# Altium project IMU V1.PrjPcb (part 1 of 2)
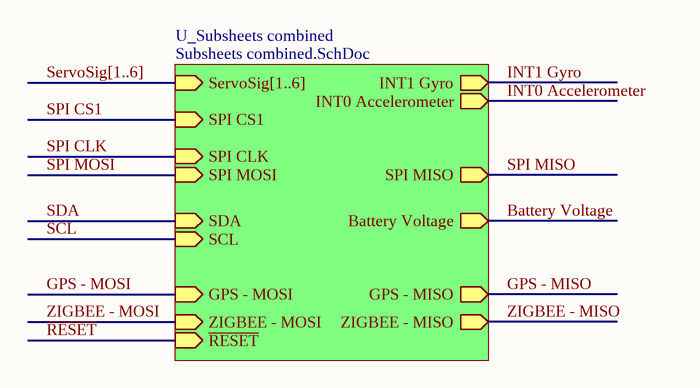
[diagram p0: main.SchDoc]
16 sheets, 83 parts. Net scope: hierarchical (ports join the sheet entries above them; power ports are global).
Board files: IMU V1.PcbDoc, Frame.PcbDoc, IMU V2.PcbDoc
Sheets:
  main.SchDoc
    U_Subsheets combined = Subsheets combined.SchDoc
      U_Accelerometer 3-AXIS - BMA180 = Accelerometer 3-AXIS - BMA180.SchDoc
      U_GYRO 3-AXIS - ITG-3200 = GYRO 3-AXIS - ITG-3200.SchDoc
      U_Pressure sensor - SCP1000-D01 = Pressure sensor - SCP1000-D01.SchDoc
      U_Temperature sensor - TC1046VNBTR = Temperature sensor - TC1046VNBTR.SchDoc
      PSU 5v1A = SMPS 1000mA - LM22672.SchDoc
      PSU 3v3 = Regulator 3v3-250mA MCP1702.SchDoc
      PWR Entry = Power Entry 24v-3pin Fused-1A5.SchDoc
      PSU 3v3A = Regulator 3v3-250mA MCP1702.SchDoc
      U_Zigbee interface = Zigbee interface.SchDoc
        PSU 3v3-xBee = Regulator 3v3-250mA MCP1702.SchDoc
      ServoConnector1 = ServoConnector.SchDoc
      ServoConnector2 = ServoConnector.SchDoc
      ServoConnector3 = ServoConnector.SchDoc
      ServoConnector4 = ServoConnector.SchDoc
      ServoConnector5 = ServoConnector.SchDoc
      ServoConnector6 = ServoConnector.SchDoc
      U_LV-MaxSonar Connector = LV-MaxSonar Connector.SchDoc
      U_Battery Voltage 12v Max = Battery Voltage 12v Max.SchDoc
      U_GPS Connector - LS20031 = GPS Connector - LS20031.SchDoc
      U_Sensor current 100A = Sensor current 100A.SchDoc
  JTAG Connector.SchDoc

## Sheet main.SchDoc
size A4; PageSetup: Record=PageOptions|CenterHorizontal=True|CenterVertical=True|PrintScale=0.97|XCorrection=1.00|YCorrection=1.00|PrintKind=0|BorderSize=5000000|LeftOffset=0|BottomOffset=0|Orientation=2|PaperLength=1000|PaperWidth=1000|Scale=100|PaperSource=273|PrintQuality=-2|MediaType=1|DitherType=10|PaperKind=A4|PrintScaleMode=1; Organization: Altium Limited; Address1: 3 Minna Close; Address2: Belrose; Address3: NSW 2085; Address4: Australia

### Sub-sheets
U_Subsheets combined = Subsheets combined.SchDoc: ServoSig[1..6] (in), INT0 Accelerometer (out), INT1 Gyro (out), ZIGBEE - MISO (out), ZIGBEE - MOSI (in), ~{RESET} (in), SPI CS1 (in), SPI CLK (in), SPI MOSI (in), SPI MISO (out), SDA (in), SCL (in), Battery Voltage (out), GPS - MISO (out), GPS - MOSI (in)

### Buses and harness runs
bus ServoSig[1..6] = sheet U_Subsheets combined/ServoSig[1..6]

### Notes on the sheet
- Disclaimer
  Any design and information, hardware or software  is provided on an "as-is" basis without warranty of any kind and any express or implied warranties, including, but not limited to, the implied warranties of merchantability and fitness for a particular purpose are disclaimed. In no event shall wnpd (or KeaDrone)be liable for any direct, indirect, incidental, special, exemplary, or consequential damages (including, but not limited to, procurement of substitute goods or services; loss of use, data, or profits; or business interruption) however caused and on any theory of liability, whether in contract, strict liability, or tort (including negligence or otherwise) arising in any way out of the use of this firmware, hardware, software or information, even if wnpd (or KeaDrone) has been advised by user of the possibility of such potential loss or damage. The user agrees to hold wnpd (or KeaDrone) harmless from and against any and all claims, losses, liabilities and expenses.
- Title
- Size:
- Date:
- A4
- Name:
- Time:
- Ing. W. Pietersz
- Revision:
- Sheet
- of
- WillyPietersz@gmail.com
- Contact:
- -
- www.wnpd.nl
- File:

## Sheet Subsheets combined.SchDoc
size A4; Organization: Altium Limited; Address1: 3 Minna Close; Address2: Belrose; Address3: NSW 2085; Address4: Australia
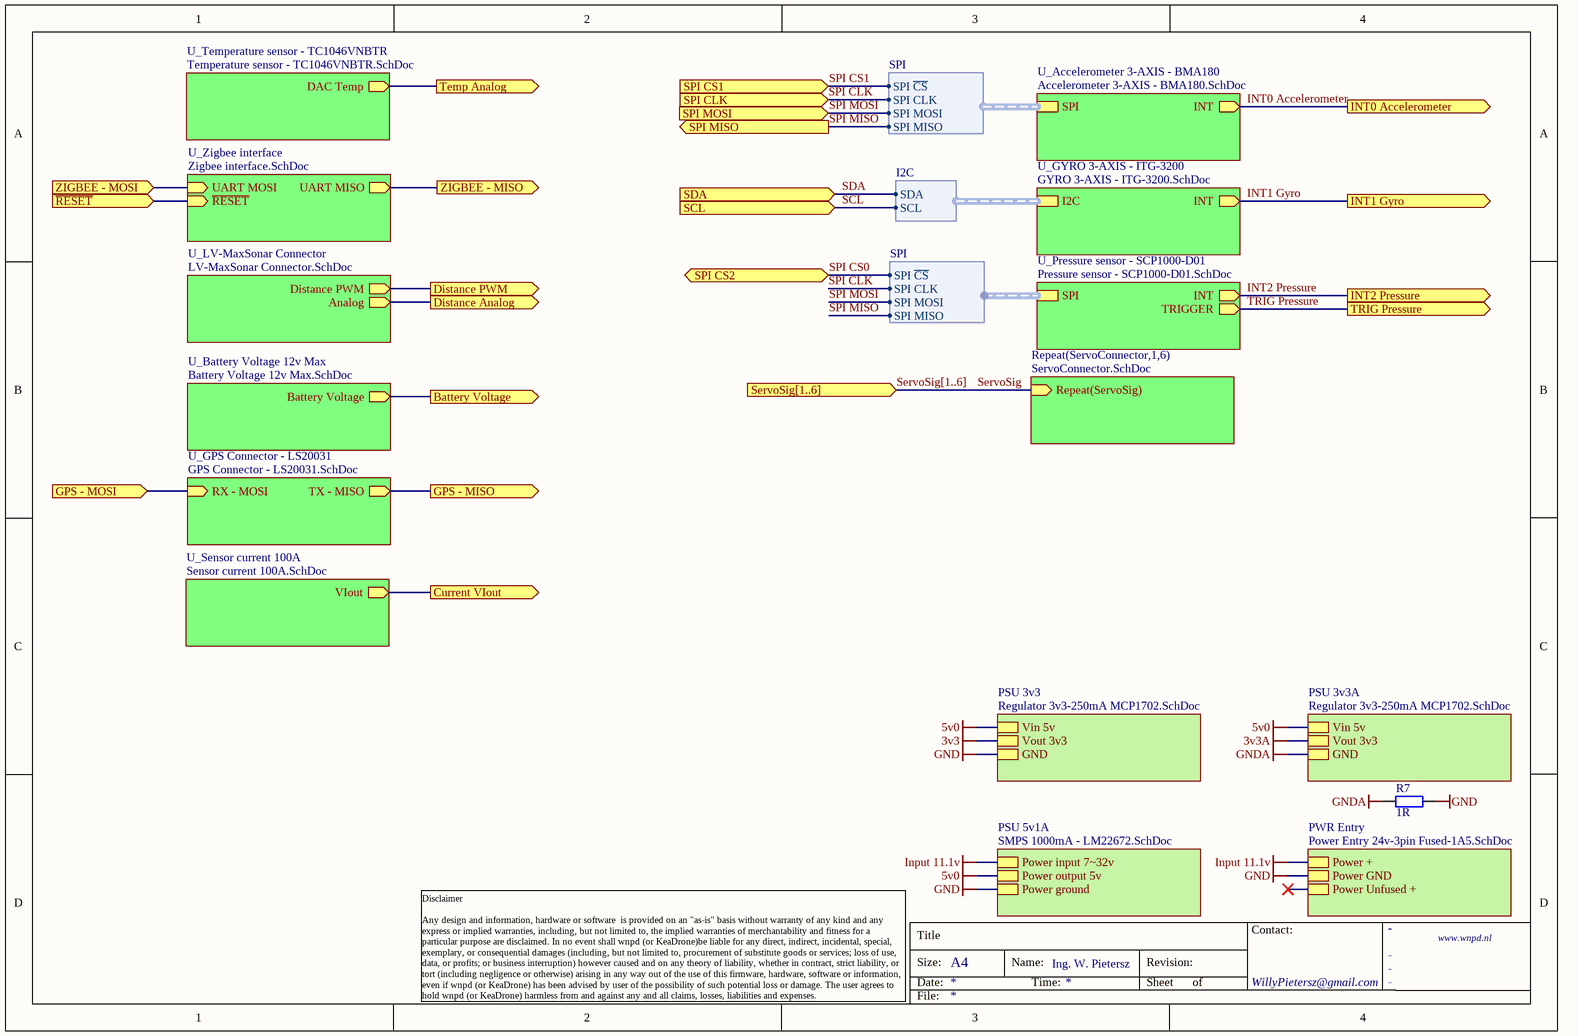
[diagram p1: Subsheets combined.SchDoc]

### Parts
R7  value 1R  [R0805]  (hidden comment: RESISTOR)

### Sub-sheets
PSU 3v3 = Regulator 3v3-250mA MCP1702.SchDoc: Vin 5v, Vout 3v3, GND
PSU 3v3A = Regulator 3v3-250mA MCP1702.SchDoc: Vin 5v, Vout 3v3, GND
PSU 5v1A = SMPS 1000mA - LM22672.SchDoc: Power input 7~32v, Power output 5v, Power ground
PWR Entry = Power Entry 24v-3pin Fused-1A5.SchDoc: Power +, Power GND, Power Unfused +
Repeat(ServoConnector,1,6) = ServoConnector.SchDoc: Repeat(ServoSig) (in)
U_Accelerometer 3-AXIS - BMA180 = Accelerometer 3-AXIS - BMA180.SchDoc: INT (out), SPI (harness SPI)
U_Battery Voltage 12v Max = Battery Voltage 12v Max.SchDoc: Battery Voltage (out)
U_GPS Connector - LS20031 = GPS Connector - LS20031.SchDoc: RX - MOSI (in), TX - MISO (out)
U_GYRO 3-AXIS - ITG-3200 = GYRO 3-AXIS - ITG-3200.SchDoc: INT (out), I2C (harness I2C)
U_LV-MaxSonar Connector = LV-MaxSonar Connector.SchDoc: Distance PWM (out), Analog (out)
U_Pressure sensor - SCP1000-D01 = Pressure sensor - SCP1000-D01.SchDoc: INT (out), TRIGGER (out), SPI (harness SPI)
U_Sensor current 100A = Sensor current 100A.SchDoc: VIout (out)
U_Temperature sensor - TC1046VNBTR = Temperature sensor - TC1046VNBTR.SchDoc: DAC Temp (out)
U_Zigbee interface = Zigbee interface.SchDoc: UART MISO (out), UART MOSI (in), ~{RESET} (in)

### Ports
Battery Voltage (out), Current VIout (out), Distance Analog (out), Distance PWM (out), GPS - MISO (out), GPS - MOSI (in), INT0 Accelerometer (out), INT1 Gyro (out), INT2 Pressure (out), SCL (in), SDA (in), ServoSig[1..6] (in), SPI CLK (in), SPI CS1 (in), SPI CS2 (in), SPI MISO (out), SPI MOSI (in), Temp Analog (out), TRIG Pressure (out), ZIGBEE - MISO (out), ZIGBEE - MOSI (in), ~{RESET} (in)

### Harnesses
SPI: SPI ~{CS}, SPI CLK, SPI MOSI, SPI MISO
I2C: SDA, SCL

### Nets
5v0: sheet PSU 5v1A/Power output 5v, sheet PSU 3v3/Vin 5v, sheet PSU 3v3A/Vin 5v
GND: R7.2 ; sheet PSU 5v1A/Power ground, sheet PSU 3v3/GND, sheet PWR Entry/Power GND
GNDA: R7.1 ; sheet PSU 3v3A/GND
Input 11.1v: sheet PSU 5v1A/Power input 7~32v, sheet PWR Entry/Power +
Battery Voltage: port Battery Voltage, sheet U_Battery Voltage 12v Max/Battery Voltage
GPS - MISO: port GPS - MISO, sheet U_GPS Connector - LS20031/TX - MISO
GPS - MOSI: port GPS - MOSI, sheet U_GPS Connector - LS20031/RX - MOSI
INT0 Accelerometer: port INT0 Accelerometer, sheet U_Accelerometer 3-AXIS - BMA180/INT
INT1 Gyro: port INT1 Gyro, sheet U_GYRO 3-AXIS - ITG-3200/INT
INT2 Pressure: port INT2 Pressure, sheet U_Pressure sensor - SCP1000-D01/INT  [project net INT0]
~{RESET}: port ~{RESET}, sheet U_Zigbee interface/~{RESET}
SCL: port SCL, sheet U_GYRO 3-AXIS - ITG-3200/I2C.SCL
SDA: port SDA, sheet U_GYRO 3-AXIS - ITG-3200/I2C.SDA
ServoSig: sheet Repeat(ServoConnector,1,6)/Repeat(ServoSig)
SPI CLK: port SPI CLK, sheet U_Accelerometer 3-AXIS - BMA180/SPI.SPI CLK, sheet U_Pressure sensor - SCP1000-D01/SPI.SPI CLK  [project net SCK]
SPI CS1: port SPI CS1, sheet U_Accelerometer 3-AXIS - BMA180/SPI.SPI ~{CS}  [project net CS1]
SPI MISO: port SPI MISO, sheet U_Accelerometer 3-AXIS - BMA180/SPI.SPI MISO, sheet U_Pressure sensor - SCP1000-D01/SPI.SPI MISO
SPI MOSI: port SPI MOSI, sheet U_Accelerometer 3-AXIS - BMA180/SPI.SPI MOSI, sheet U_Pressure sensor - SCP1000-D01/SPI.SPI MOSI
TRIG Pressure: port TRIG Pressure, sheet U_Pressure sensor - SCP1000-D01/TRIGGER
UART MISO: port ZIGBEE - MOSI, sheet U_Zigbee interface/UART MOSI
UART MOSI: port ZIGBEE - MISO, sheet U_Zigbee interface/UART MISO
Vout Temp: port Temp Analog, sheet U_Temperature sensor - TC1046VNBTR/DAC Temp
NetC33_2: port Current VIout, sheet U_Sensor current 100A/VIout
NetP?#5_3: port Distance Analog, sheet U_LV-MaxSonar Connector/Analog
NetP?#5_4: port Distance PWM, sheet U_LV-MaxSonar Connector/Distance PWM

### Buses and harness runs
bus ServoSig[1..6] = port ServoSig[1..6]

### Notes on the sheet
- Title
- Size:
- Date:
- A4
- Name:
- Time:
- Ing. W. Pietersz
- Revision:
- Sheet
- of
- WillyPietersz@gmail.com
- Contact:
- -
- www.wnpd.nl
- Disclaimer
  Any design and information, hardware or software  is provided on an "as-is" basis without warranty of any kind and any express or implied warranties, including, but not limited to, the implied warranties of merchantability and fitness for a particular purpose are disclaimed. In no event shall wnpd (or KeaDrone)be liable for any direct, indirect, incidental, special, exemplary, or consequential damages (including, but not limited to, procurement of substitute goods or services; loss of use, data, or profits; or business interruption) however caused and on any theory of liability, whether in contract, strict liability, or tort (including negligence or otherwise) arising in any way out of the use of this firmware, hardware, software or information, even if wnpd (or KeaDrone) has been advised by user of the possibility of such potential loss or damage. The user agrees to hold wnpd (or KeaDrone) harmless from and against any and all claims, losses, liabilities and expenses.
- File:

### Library data of the parts
R7 = 1R: Manufacturer 1: Panasonic; Manufacturer 1 Part No: ERJT06J1R0V; Power: 0.25W; Tolerance: 0.05; LatestRevision Note: Initial Release; Published: 8-Jun-2000; LatestRevisionDate: 17-Jul-2002; LatestRevisionNote: Re-released for DXP Platform.; PackageReference: AXIAL-0.4; Publisher: Altium Limited; Part Number: 1R; Type: Film; Package: 0805; Component Type: Standard; LatestRevision Date: 30-7-2010; Author: Willy Pietersz; ROHS: Y; Supplier 2: Farnell; Supplier Part Number 2: 1618236; ComponentLink1Description: Manufacturer; ComponentLink2Description: Datasheet

## Sheet Accelerometer 3-AXIS - BMA180.SchDoc: Accelerometer, 3-Axis - SPI
size A4; Organization: Altium Limited; Address1: 3 Minna Close; Address2: Belrose; Address3: NSW 2085; Address4: Australia
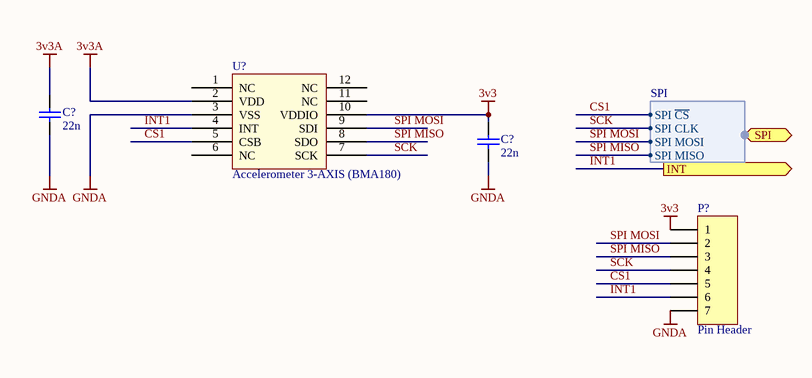
[diagram p2: Accelerometer 3-AXIS - BMA180.SchDoc]

### Parts
(Parts that share a designator on the sheet are numbered #1, #2 ... from top to bottom, then left to right.)
C?#1  22n  [C0805]
C?#2  22n  [C0805]
P?#1  Pin Header  [PH1x7_2.54]
U?#1  Accelerometer 3-AXIS (BMA180)  [BMA180]

### Ports
INT (out), SPI (harness SPI)

### Harnesses
SPI: SPI ~{CS}, SPI CLK, SPI MOSI, SPI MISO

### Nets
3v3: C?#2.2 P?#1.1 U?#1.10(VDDIO)
3v3A: C?#1.2 U?#1.2(VDD)
GNDA: C?#1.1 C?#2.1 P?#1.7 U?#1.3(VSS)
CS1: P?#1.5 U?#1.5(CSB) ; port SPI.SPI ~{CS}
INT1: P?#1.6 U?#1.4(INT) ; port INT  [project net INT0 Accelerometer]
SCK: P?#1.4 U?#1.7(SCK) ; port SPI.SPI CLK
SPI MISO: P?#1.3 U?#1.8(SDO) ; port SPI.SPI MISO
SPI MOSI: P?#1.2 U?#1.9(SDI) ; port SPI.SPI MOSI

Not connected (* = marked no-connect by the designer): U?#1 1(NC) 6(NC) 11(NC) 12(NC)

### Notes on the sheet
- Disclaimer
  Any design and information, hardware or software  is provided on an "as-is" basis without warranty of any kind and any express or implied warranties, including, but not limited to, the implied warranties of merchantability and fitness for a particular purpose are disclaimed. In no event shall wnpd (or KeaDrone)be liable for any direct, indirect, incidental, special, exemplary, or consequential damages (including, but not limited to, procurement of substitute goods or services; loss of use, data, or profits; or business interruption) however caused and on any theory of liability, whether in contract, strict liability, or tort (including negligence or otherwise) arising in any way out of the use of this firmware, hardware, software or information, even if wnpd (or KeaDrone) has been advised by user of the possibility of such potential loss or damage. The user agrees to hold wnpd (or KeaDrone) harmless from and against any and all claims, losses, liabilities and expenses.
- Title
- Size:
- Date:
- A4
- Name:
- Time:
- Ing. W. Pietersz
- Revision:
- Sheet
- of
- WillyPietersz@gmail.com
- Contact:
- -
- www.wnpd.nl
- File:

### Library data of the parts
C?#1 C?#2 = 22n: Tolerance: 0.1; LatestRevision Note: Initial Release; Part Number: 22n; Value: 22n; Package: 0805; Component Type: Standard; LatestRevision Date: 31-7-2010; Author: Willy Pietersz; ComponentLink1Description: Manufacturer; ComponentLink2Description: Datasheet
P?#1 = PH1x7: Con1x7; Part Number: PH1x7; Pitch: 2.54; LatestRevision Note: Initial Release; Type: Pin Header; Number Of Pins: 7; Component Type: Standard; LatestRevision Date: 23-11-2010; Author: Willy Pietersz; Supplier 2: Farnell
U?#1 = BMA180: Part Number: BMA180; Component Type: Sensor; Supplier 1: Digikey; Supplier Part Number 1: 828-1019-1-ND; ComponentLink1Description: Datasheet; ComponentLink1URL: http://www.bosch-sensortec.com/content/language1/downloads/BST-BMA180-FL000-03.pdf

## Sheet GYRO 3-AXIS - ITG-3200.SchDoc: Gyroscope, 3-Axis - I2C
size A4; Organization: Altium Limited; Address1: 3 Minna Close; Address2: Belrose; Address3: NSW 2085; Address4: Australia
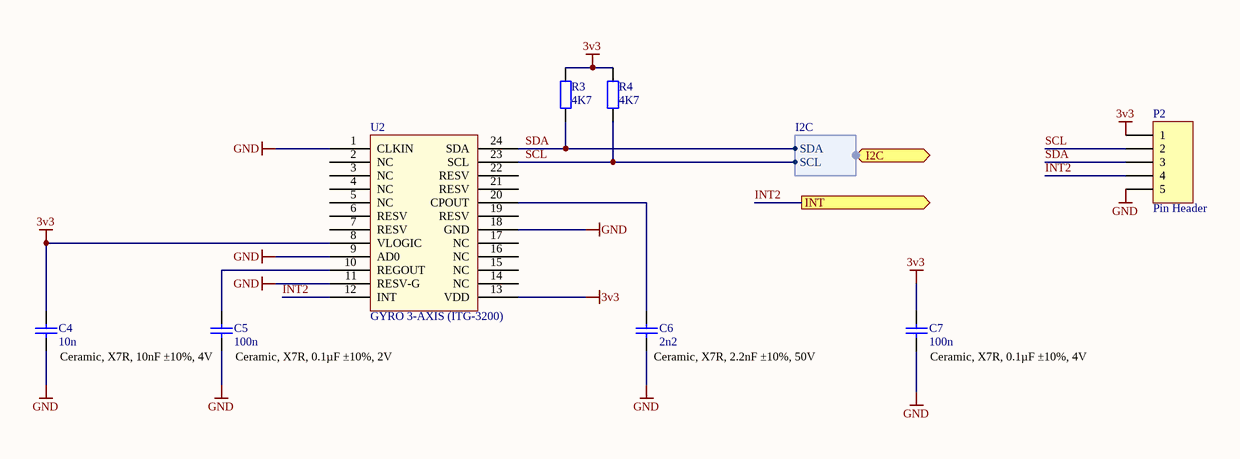
[diagram p3: GYRO 3-AXIS - ITG-3200.SchDoc]

### Parts
C4  10n  [C0805]
C5  100n  [C0805]
C6  2n2  [C0805]
C7  100n  [C0805]
P2  Pin Header  [PH1x5_2.54]
R3  value 4K7  [R0805]  (hidden comment: RESISTOR)
R4  value 4K7  [R0805]  (hidden comment: RESISTOR)
U2  GYRO 3-AXIS (ITG-3200)  [QFN50P400X400-24V2M - GYRO 3axis]

### Ports
I2C (harness I2C), INT (out)

### Harnesses
I2C: SDA, SCL

### Nets
3v3: C4.2 C7.2 P2.1 R3.1 R4.1 U2.8(VLOGIC) U2.13(VDD)
GND: C4.1 C5.1 C6.1 C7.1 P2.5 U2.1(CLKIN) U2.9(AD0) U2.11(RESV-G) U2.18(GND)
INT2: P2.4 U2.12(INT) ; port INT  [project net INT1 Gyro]
SCL: P2.2 R4.2 U2.23(SCL) ; port I2C.SCL
SDA: P2.3 R3.2 U2.24(SDA) ; port I2C.SDA
NetC5_2: C5.2 U2.10(REGOUT)
NetC6_2: C6.2 U2.20(CPOUT)

Not connected (* = marked no-connect by the designer): U2 2(NC) 3(NC) 4(NC) 5(NC) 6(RESV) 7(RESV) 14(NC) 15(NC) 16(NC) 17(NC) 19(RESV) 21(RESV) 22(RESV)

### Notes on the sheet
- Ceramic, X7R, 10nF ±10%, 4V
- (near C5) Ceramic, X7R, 0.1µF ±10%, 2V
- (near C6) Ceramic, X7R, 2.2nF ±10%, 50V
- (near C7) Ceramic, X7R, 0.1µF ±10%, 4V
- Disclaimer
  Any design and information, hardware or software  is provided on an "as-is" basis without warranty of any kind and any express or implied warranties, including, but not limited to, the implied warranties of merchantability and fitness for a particular purpose are disclaimed. In no event shall wnpd (or KeaDrone)be liable for any direct, indirect, incidental, special, exemplary, or consequential damages (including, but not limited to, procurement of substitute goods or services; loss of use, data, or profits; or business interruption) however caused and on any theory of liability, whether in contract, strict liability, or tort (including negligence or otherwise) arising in any way out of the use of this firmware, hardware, software or information, even if wnpd (or KeaDrone) has been advised by user of the possibility of such potential loss or damage. The user agrees to hold wnpd (or KeaDrone) harmless from and against any and all claims, losses, liabilities and expenses.
- Title
- Size:
- Date:
- A4
- Name:
- Time:
- Ing. W. Pietersz
- Revision:
- Sheet
- of
- WillyPietersz@gmail.com
- Contact:
- -
- www.wnpd.nl
- File:

### Library data of the parts
C4 = 10n: Tolerance: 0.1; LatestRevision Note: Initial Release; Part Number: 10n; Value: 10n; Package: 0805; Component Type: Standard; LatestRevision Date: 31-7-2010; Author: Willy Pietersz; ComponentLink1Description: Manufacturer; ComponentLink2Description: Datasheet
C5 C7 = 100n: Tolerance: 0.1; LatestRevision Note: Initial Release; Part Number: 100n; Value: 100n; Package: 0805; Component Type: Standard; LatestRevision Date: 31-7-2010; Author: Willy Pietersz; Supplier 2: Farnell; Supplier Part Number 2: 1759266; ComponentLink1Description: Manufacturer; ComponentLink2Description: Datasheet
C6 = 2n2: Tolerance: 0.1; LatestRevision Note: Initial Release; Part Number: 2n2; Value: 2n2; Package: 0805; Component Type: Standard; LatestRevision Date: 31-7-2010; Author: Willy Pietersz; ComponentLink1Description: Manufacturer; ComponentLink2Description: Datasheet
P2 = PH1x5: Con1x5; Part Number: PH1x5; Pitch: 2.54; LatestRevision Note: Initial Release; Type: Pin Header; Number Of Pins: 5; Component Type: Standard; LatestRevision Date: 23-11-2010; Author: Willy Pietersz; Supplier 2: Farnell
R3 R4 = 4K7: Manufacturer 1: Panasonic; Manufacturer 1 Part No: ERJT06J472V; Power: 0.25W; Tolerance: 0.05; LatestRevision Note: Initial Release; Published: 8-Jun-2000; LatestRevisionDate: 17-Jul-2002; LatestRevisionNote: Re-released for DXP Platform.; PackageReference: AXIAL-0.4; Publisher: Altium Limited; Part Number: 4K7; Type: Film; Package: 0805; Component Type: Standard; LatestRevision Date: 30-7-2010; Author: Willy Pietersz; ROHS: Y; Supplier 2: Farnell; Supplier Part Number 2: 1577368; ComponentLink1Description: Manufacturer; ComponentLink2Description: Datasheet
U2 = ITG-3200: Gyro, 3-axis; Part Number: ITG-3200; Component Type: Sensor; Supplier 1: Sparkfun; Supplier Part Number 1: ITG-3200; ComponentLink1Description: Datasheet; ComponentLink1URL: http://www.sparkfun.com/datasheets/Sensors/Gyro/PS-ITG-3200-00-01.4.pdf

## Sheet Pressure sensor - SCP1000-D01.SchDoc: Pressure sensor -SPI
size A4; Organization: Altium Limited; Address1: 3 Minna Close; Address2: Belrose; Address3: NSW 2085; Address4: Australia
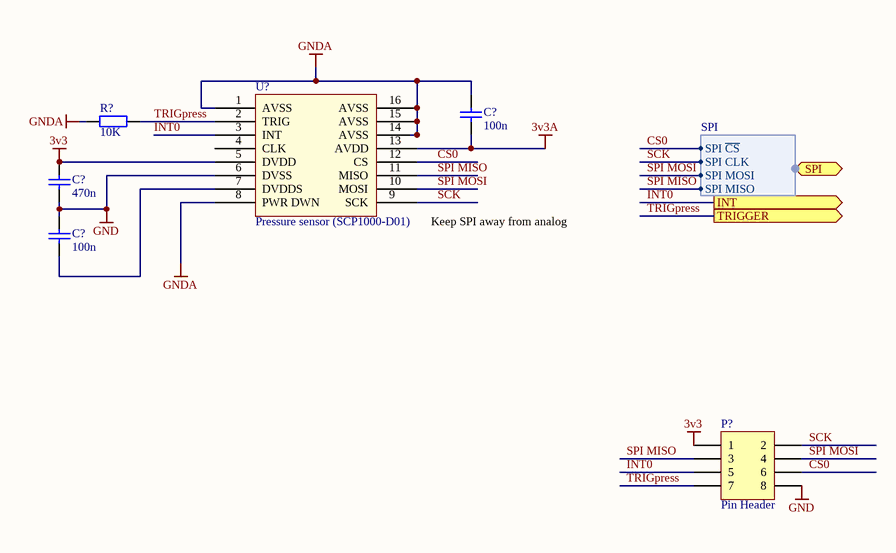
[diagram p4: Pressure sensor - SCP1000-D01.SchDoc]

### Parts
(Parts that share a designator on the sheet are numbered #1, #2 ... from top to bottom, then left to right.)
C?#3  100n  [C0805]
C?#4  470n  [C0805]
C?#5  100n  [C0805]
P?#2  Pin Header  [PH2x4_2.54]
R?  value 10K  [R0805]  (hidden comment: RESISTOR)
U?#2  Pressure sensor (SCP1000-D01)  [SCP1000-D01]

### Ports
INT (out), SPI (harness SPI), TRIGGER (out)

### Harnesses
SPI: SPI ~{CS}, SPI CLK, SPI MOSI, SPI MISO

### Nets
3v3: C?#4.2 P?#2.1 U?#2.5(DVDD)
3v3A: C?#3.1 U?#2.13(AVDD)
GND: C?#4.1 C?#5.2 P?#2.8 U?#2.6(DVSS)
GNDA: C?#3.2 R?.1 U?#2.1(AVSS) U?#2.8(PWR_DWN) U?#2.14(AVSS) U?#2.15(AVSS) U?#2.16(AVSS)
CS0: P?#2.6 U?#2.12(CS) ; port SPI.SPI ~{CS}
INT0: P?#2.5 U?#2.3(INT) ; port INT
SCK: P?#2.2 U?#2.9(SCK) ; port SPI.SPI CLK
SPI MISO: P?#2.3 U?#2.11(MISO) ; port SPI.SPI MISO
SPI MOSI: P?#2.4 U?#2.10(MOSI) ; port SPI.SPI MOSI
TRIGpress: P?#2.7 R?.2 U?#2.2(TRIG) ; port TRIGGER  [project net TRIG Pressure]
NetC?#5_1: C?#5.1 U?#2.7(DVDDS)

Not connected (* = marked no-connect by the designer): U?#2 4(CLK)

### Notes on the sheet
- Keep SPI away from analog
- Disclaimer
  Any design and information, hardware or software  is provided on an "as-is" basis without warranty of any kind and any express or implied warranties, including, but not limited to, the implied warranties of merchantability and fitness for a particular purpose are disclaimed. In no event shall wnpd (or KeaDrone)be liable for any direct, indirect, incidental, special, exemplary, or consequential damages (including, but not limited to, procurement of substitute goods or services; loss of use, data, or profits; or business interruption) however caused and on any theory of liability, whether in contract, strict liability, or tort (including negligence or otherwise) arising in any way out of the use of this firmware, hardware, software or information, even if wnpd (or KeaDrone) has been advised by user of the possibility of such potential loss or damage. The user agrees to hold wnpd (or KeaDrone) harmless from and against any and all claims, losses, liabilities and expenses.
- Title
- Size:
- Date:
- A4
- Name:
- Time:
- Ing. W. Pietersz
- Revision:
- Sheet
- of
- WillyPietersz@gmail.com
- Contact:
- -
- www.wnpd.nl
- File:

### Library data of the parts
C?#3 C?#5 = 100n: as C5 on sheet GYRO 3-AXIS - ITG-3200; Part Number: 100n; Value: 100n; Package: 0805; Component Type: Standard; LatestRevision Date: 31-7-2010; Author: Willy Pietersz; Supplier 2: Farnell; Supplier Part Number 2: 1759266; ComponentLink1Description: Manufacturer; ComponentLink2Description: Datasheet
C?#4 = 470n: Tolerance: 0.1; LatestRevision Note: Initial Release; Part Number: 470n; Value: 470n; Package: 0805; Component Type: Standard; LatestRevision Date: 31-7-2010; Author: Willy Pietersz; ComponentLink1Description: Manufacturer; ComponentLink2Description: Datasheet
P?#2 = PH2x4: Header, 4-Pin, Dual row; Part Number: PH2x4; Pitch: 2.54; LatestRevision Note: Initial Release; Type: Pin Header; Number Of Pins: 8; Component Type: Standard; LatestRevision Date: 23-11-2010; Author: Willy Pietersz; Supplier 2: Farnell
R? = 10K: Manufacturer 1: Panasonic; Manufacturer 1 Part No: ERJT06J103V; Power: 0.25W; Tolerance: 0.05; LatestRevision Note: Initial Release; Published: 8-Jun-2000; LatestRevisionDate: 17-Jul-2002; LatestRevisionNote: Re-released for DXP Platform.; PackageReference: AXIAL-0.4; Publisher: Altium Limited; Part Number: 10K; Type: Film; Package: 0805; Component Type: Standard; LatestRevision Date: 30-7-2010; Author: Willy Pietersz; ROHS: Y; Supplier 2: Farnell; Supplier Part Number 2: 1618242; ComponentLink1Description: Manufacturer; ComponentLink2Description: Datasheet
U?#2 = SCP1000-D01: Part Number: SCP1000-D01; Component Type: Sensor; Supplier 1: Sparkfun; Supplier Part Number 1: SCP1000-D01; ComponentLink1Description: Datasheet; ComponentLink1URL: http://www.sparkfun.com/datasheets/Components/SCP1000-D01.pdf

## Sheet Temperature sensor - TC1046VNBTR.SchDoc: Temperature sensor - Analog out
size A4; Organization: Altium Limited; Address1: 3 Minna Close; Address2: Belrose; Address3: NSW 2085; Address4: Australia
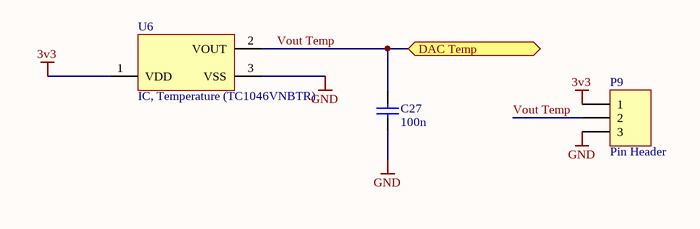
[diagram p5: Temperature sensor - TC1046VNBTR.SchDoc]

### Parts
C27  100n  [C0805]
P9  Pin Header  [PH1x3_2.54]
U6  IC, Temperature (TC1046VNBTR)  [SOT-23-NB3_M]

### Ports
DAC Temp

### Nets
3v3: P9.1 U6.1(VDD)
GND: C27.1 P9.3 U6.3(VSS)
Vout Temp: C27.2 P9.2 U6.2(VOUT) ; port DAC Temp

### Notes on the sheet
- Disclaimer
  Any design and information, hardware or software  is provided on an "as-is" basis without warranty of any kind and any express or implied warranties, including, but not limited to, the implied warranties of merchantability and fitness for a particular purpose are disclaimed. In no event shall wnpd (or KeaDrone)be liable for any direct, indirect, incidental, special, exemplary, or consequential damages (including, but not limited to, procurement of substitute goods or services; loss of use, data, or profits; or business interruption) however caused and on any theory of liability, whether in contract, strict liability, or tort (including negligence or otherwise) arising in any way out of the use of this firmware, hardware, software or information, even if wnpd (or KeaDrone) has been advised by user of the possibility of such potential loss or damage. The user agrees to hold wnpd (or KeaDrone) harmless from and against any and all claims, losses, liabilities and expenses.
- Title
- Size:
- Date:
- A4
- Name:
- Time:
- Ing. W. Pietersz
- Revision:
- Sheet
- of
- WillyPietersz@gmail.com
- Contact:
- -
- www.wnpd.nl
- File:

### Library data of the parts
C27 = 100n: as C5 on sheet GYRO 3-AXIS - ITG-3200; Part Number: 100n; Value: 100n; Package: 0805; Component Type: Standard; LatestRevision Date: 31-7-2010; Author: Willy Pietersz; Supplier 2: Farnell; Supplier Part Number 2: 1759266; ComponentLink1Description: Manufacturer; ComponentLink2Description: Datasheet
P9 = PH1x3: Con1x3; Part Number: PH1x3; Pitch: 2.54; LatestRevision Note: Initial Release; Type: Pin Header; Number Of Pins: 3; Component Type: Standard; LatestRevision Date: 23-11-2010; Author: Willy Pietersz; Supplier 2: Farnell
U6 = TC1046VNBTR: High Precision Temperature-to-Voltage Converter, 3-Pin SOT-23, Extended Temperature, Tape and Reel; FirstPublished: 29-Jan-2009; DatasheetVersion: revB, Feb-2003; PackageVersion: revBB, Aug-2009; PackageReference: SOT-23-NB3; Publisher: Altium Limited; PackageDescription: 3-Lead Plastic Small Outline Transistor (NB) [SOT-23]; Supplier 1: Digi-Key; Supplier Part Number 1: TC1046VNBTRTR-ND; Supplier 2: Digi-Key; Supplier Part Number 2: TC1046VNBTRCT-ND; Supplier 3: Digi-Key; Supplier Part Number 3: TC1046VNBTRDKR-ND; Supplier 4: Farnell; Supplier Part Number 4: 1212685; Supplier 5: Newark; Supplier Part Number 5: 89C8092; Code_IPC: SOT23-3; ComponentLink1Description: Datasheet; ComponentLink1URL: http://ww1.microchip.com/downloads/en/DeviceDoc/21496b.pdf; ComponentLink2Description: Packaging Specification; ComponentLink2URL: http://www.microchip.com/stellent/groups/techpub_sg/documents/packagingspec/en012702.pdf; ComponentLink3Description: Microchip.com Home; ComponentLink3URL: http://www.microchip.com/

## Sheet SMPS 1000mA - LM22672.SchDoc: SMPS 5v 1A - low ripple
size A4; Organization: Altium Limited; Address1: 3 Minna Close; Address2: Belrose; Address3: NSW 2085; Address4: Australia
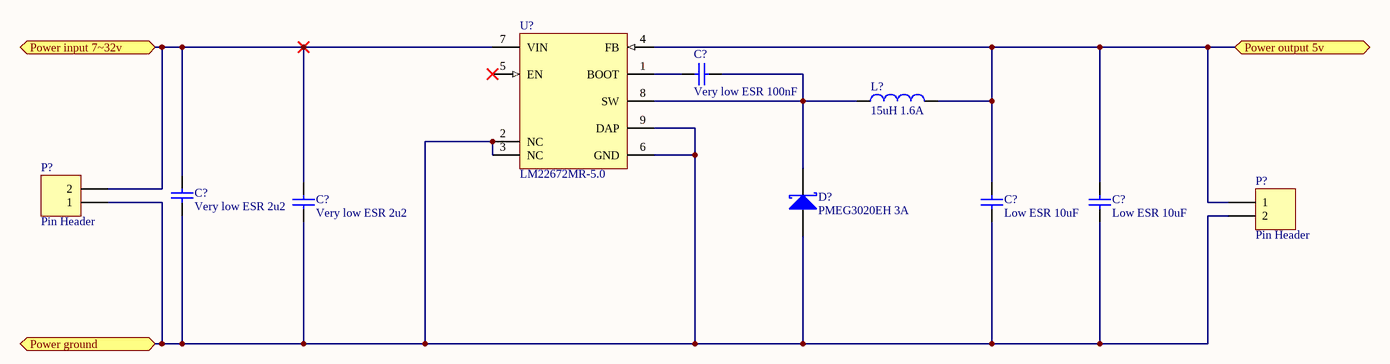
[diagram p6: SMPS 1000mA - LM22672.SchDoc]

### Parts
(Parts that share a designator on the sheet are numbered #1, #2 ... from top to bottom, then left to right.)
C?#6  Very low ESR 100nF  [C0805]
C?#7  Very low ESR 2u2  [C1210]
C?#8  Very low ESR 2u2  [C1210]
C?#9  Low ESR 10uF  [C1210]
C?#10  Low ESR 10uF  [C1210]
D?  PMEG3020EH 3A  [SOD123F]
L?  value 15uH 1.6A  [Square_7.3x7.3x4.5]  (hidden comment: inductor)
P?#3  Pin Header  [PH1x2_2.54]
P?#4  Pin Header  [PH1x2_2.54]
U?#3  LM22672MR-5.0  [MRA08B_N]

### Ports
Power ground, Power input 7~32v, Power output 5v

### Nets
5v0: C?#9.2 C?#10.2 L?.2 P?#4.1 U?#3.4(FB) ; port Power output 5v
GND: C?#7.1 C?#8.1 C?#9.1 C?#10.1 D?.1 P?#3.1 P?#4.2 U?#3.2(NC) U?#3.3(NC) U?#3.6(GND) U?#3.9(DAP) ; port Power ground
Input 11.1v: C?#7.2 C?#8.2 P?#3.2 U?#3.7(VIN) ; port Power input 7~32v
NetC?#6_1: C?#6.1 U?#3.1(BOOT)
NetC?#6_2: C?#6.2 D?.2 L?.1 U?#3.8(SW)

Not connected (* = marked no-connect by the designer): U?#3 5(EN)*

### Notes on the sheet
- Disclaimer
  Any design and information, hardware or software  is provided on an "as-is" basis without warranty of any kind and any express or implied warranties, including, but not limited to, the implied warranties of merchantability and fitness for a particular purpose are disclaimed. In no event shall wnpd (or KeaDrone)be liable for any direct, indirect, incidental, special, exemplary, or consequential damages (including, but not limited to, procurement of substitute goods or services; loss of use, data, or profits; or business interruption) however caused and on any theory of liability, whether in contract, strict liability, or tort (including negligence or otherwise) arising in any way out of the use of this firmware, hardware, software or information, even if wnpd (or KeaDrone) has been advised by user of the possibility of such potential loss or damage. The user agrees to hold wnpd (or KeaDrone) harmless from and against any and all claims, losses, liabilities and expenses.
- Title
- Size:
- Date:
- A4
- Name:
- Time:
- Ing. W. Pietersz
- Revision:
- Sheet
- of
- WillyPietersz@gmail.com
- Contact:
- -
- www.wnpd.nl
- File:

### Library data of the parts
C?#6 = 0.01uF-0805-X7R: Voltage: 50V; Type: X7R; Tolerance: 0.1; Part Number: 0.01uF-0805-X7R; Value: 0.01uF-0805-X7R; Package: 0805; Component Type: Low ESR; LatestRevision Date: 14-9-2010; Author: Willem Pietersz; Supplier 2: Farnell; Supplier Part Number 2: 1692287
C?#7 C?#8 = 2.2uF-1210-X7R: Voltage: 50V; Type: X7R; Tolerance: 0.1; Part Number: 2.2uF-1210-X7R; Value: 2.2uF-1210-X7R; Package: 1210; Component Type: Low ESR; LatestRevision Date: 14-9-2010; Author: Willem Pietersz; Supplier 2: Farnell; Supplier Part Number 2: 1414066
C?#9 C?#10 = 10uF-1210-X5R: Voltage: 10V; Type: X5R; Tolerance: 0.1; Part Number: 10uF-1210-X5R; Value: 10uF-1210-X5R; Package: 1210; Component Type: Low ESR; LatestRevision Date: 14-9-2010; Author: Willem Pietersz; Supplier 2: Farnell; Supplier Part Number 2: 1759458
D? = PMEG3020EH: Voltage: 30V; Current: 2A; Part Number: PMEG3020EH; Type: Schottky; Component Type: Standard; Supplier 2: Farnell; Supplier Part Number 2: 1510687; ComponentLink2Description: Datasheet; ComponentLink2URL: http://www.nxp.com/documents/data_sheet/PMEG3020EH_EJ.pdf
L? = 15uH-Shield-1.6A-Wurth: Type: Shielded; Part Number: 15uH-Shield-1.6A-Wurth; Supplier 2: Farnell; Supplier Part Number 2: 1635989; ComponentLink2Description: Datasheet; ComponentLink2URL: http://www.farnell.com/datasheets/69698.pdf
P?#3 P?#4 = PH1x2: Con1x2; Part Number: PH1x2; Pitch: 2.54; LatestRevision Note: Initial Release; Type: Pin Header; Number Of Pins: 2; Component Type: Standard; LatestRevision Date: 23-11-2010; Author: Willy Pietersz; Supplier 2: Farnell
U?#3 = LM22674MR-5.0: Power, 500mA SIMPLE SWITCHER, Step-Down Voltage Regulator with Precision Enable; Manufacturer: National Semiconductor; PackageTopMarking: NSXYTT*L22674*5.0; PowerWise: N; FirstPublished: 4-Dec-2008; DatasheetVersion: Oct-2008; PackageVersion: revB, Dec-2007; PackageReference: MRA08B; Publisher: Altium Limited; PackageDescription: Molded, PSOP .193 x .154 x .058in, 8 Lead, .050in Pitch, Large DAP; CompType: Switcher; PartNumber: LM22674MR-5.0; RoHS: Y; PinCount: 8; DigiKeyPartNumber: LM22674MR-5.0-ND; Code_JEDEC: MS-012-AA; ComponentLink1Description: LM22674 Datasheet; ComponentLink1URL: http://www.national.com/ds/LM/LM22674.pdf; ComponentLink2Description: LM22674 Web Page; ComponentLink2URL: http://www.national.com/pf/LM/LM22674.html; ComponentLink3Description: MRA08B Package Drawing; ComponentLink3URL: http://www.national.com/packaging/folders/mra08b.html

## Sheet Regulator 3v3-250mA MCP1702.SchDoc: Regulator 3v3 out
size A4; Organization: Altium Limited; Address1: 3 Minna Close; Address2: Belrose; Address3: NSW 2085; Address4: Australia
Used 3 times, as channels U_Subsheets combined/PSU 3v3, U_Subsheets combined/PSU 3v3A, U_Subsheets combined/U_Zigbee interface/PSU 3v3-xBee. Parts and nets are listed once, with the designators drawn on the sheet.
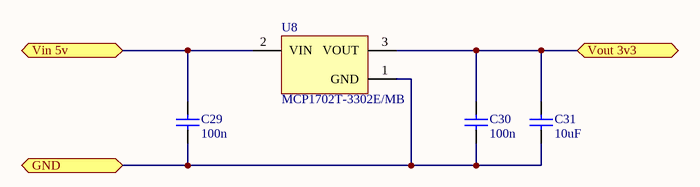
[diagram p7: Regulator 3v3-250mA MCP1702.SchDoc]

### Parts
C29  100n  [C0805]
C30  100n  [C0805]
C31  10uF  [C1206]
U8  MCP1702T-3302E/MB  [SOT-89-MB3_N]

### Ports
GND, Vin 5v, Vout 3v3

### Nets
GND: C29.1 C30.1 C31.1 U8.1(GND) ; port GND
Vin 5v: C29.2 U8.2(VIN) ; port Vin 5v
Vout 3v3: C30.2 C31.2 U8.3(VOUT) ; port Vout 3v3

### Channels
U_Subsheets combined/PSU 3v3: designators end in A; ports GND=GND Vin 5v=5v0 Vout 3v3=3v3
U_Subsheets combined/PSU 3v3A: designators end in B; ports GND=GNDA Vin 5v=5v0 Vout 3v3=3v3A
U_Subsheets combined/U_Zigbee interface/PSU 3v3-xBee: designators end in C; ports GND=GND Vin 5v=5v0 Vout 3v3=3v3-zigbee

### Notes on the sheet
- Disclaimer
  Any design and information, hardware or software  is provided on an "as-is" basis without warranty of any kind and any express or implied warranties, including, but not limited to, the implied warranties of merchantability and fitness for a particular purpose are disclaimed. In no event shall wnpd (or KeaDrone)be liable for any direct, indirect, incidental, special, exemplary, or consequential damages (including, but not limited to, procurement of substitute goods or services; loss of use, data, or profits; or business interruption) however caused and on any theory of liability, whether in contract, strict liability, or tort (including negligence or otherwise) arising in any way out of the use of this firmware, hardware, software or information, even if wnpd (or KeaDrone) has been advised by user of the possibility of such potential loss or damage. The user agrees to hold wnpd (or KeaDrone) harmless from and against any and all claims, losses, liabilities and expenses.
- Title
- Size:
- Date:
- A4
- Name:
- Time:
- Ing. W. Pietersz
- Revision:
- Sheet
- of
- WillyPietersz@gmail.com
- Contact:
- -
- www.wnpd.nl
- File:

### Library data of the parts
C29 C30 = 100n: as C5 on sheet GYRO 3-AXIS - ITG-3200; Part Number: 100n; Value: 100n; Package: 0805; Component Type: Standard; LatestRevision Date: 31-7-2010; Author: Willy Pietersz; Supplier 2: Farnell; Supplier Part Number 2: 1759266; ComponentLink1Description: Manufacturer; ComponentLink2Description: Datasheet
C31 = 10uF: Voltage: 10V; Type: Ceramic; Tolerance: 0.1; LatestRevision Note: Initial Release; Part Number: 10uF; Value: 10uF; Package: 1206; Component Type: Standard; LatestRevision Date: 14-9-2010; Author: Willem Pietersz; Supplier 2: Farnell; Supplier Part Number 2: 1759434; ComponentLink1Description: Manufacturer; ComponentLink2Description: Datasheet
U8 = MCP1702T-3302E/MB: Power, 250 mA Low Quiescent Current LDO Regulator, 3-Pin SOT-89, Extended Temperature, Tape and Reel; FirstPublished: 29-Jan-2009; LatestRevisionDate: 02-Dec-2009; LatestRevisionNote: Updated to datasheet revision D, Jun-2009; DatasheetVersion: revD, Jun-2009; PackageVersion: revBB, Aug-2009; PackageReference: SOT-89-MB3; Publisher: Altium Limited; PackageDescription: 3-Lead Plastic Small Outline Transistor Header (MB) [SOT-89]; Supplier 1: Digi-Key; Supplier Part Number 1: MCP1702T-3302E/MB-ND; Supplier 2: Farnell; Supplier Part Number 2: 1605558; Supplier 3: Newark; Supplier Part Number 3: 56K6993; Code_IPC: SOT89; ComponentLink1Description: Datasheet; ComponentLink1URL: http://ww1.microchip.com/downloads/en/DeviceDoc/22008d.pdf; ComponentLink2Description: Packaging Specification; ComponentLink2URL: http://www.microchip.com/stellent/groups/techpub_sg/documents/packagingspec/en012702.pdf; ComponentLink3Description: Microchip.com Home; ComponentLink3URL: http://www.microchip.com/

## Sheet Power Entry 24v-3pin Fused-1A5.SchDoc: Power Supply Entry
size A4; Organization: Altium Limited; Address1: 3 Minna Close; Address2: Belrose; Address3: NSW 2085; Address4: Australia
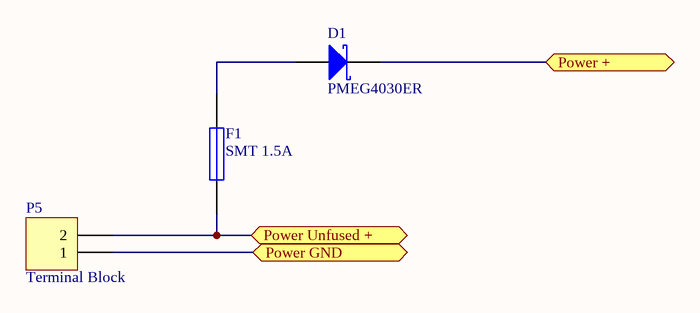
[diagram p8: Power Entry 24v-3pin Fused-1A5.SchDoc]

### Parts
D1  PMEG4030ER  [SOD123W]
F1  SMT 1.5A  [F_2920L185]
P5  Terminal Block  [TB2_3.5]

### Ports
Power +, Power GND, Power Unfused +

### Nets
GND: P5.1 ; port Power GND
Input 11.1v: D1.2 ; port Power +
NetD1_1: D1.1 F1.2
NetF1_1: F1.1 P5.2 ; port Power Unfused +

### Notes on the sheet
- Title
- Size:
- Date:
- A4
- Name:
- Time:
- Ing. W. Pietersz
- Revision:
- Sheet
- of
- WillyPietersz@gmail.com
- Contact:
- -
- www.wnpd.nl
- Disclaimer
  Any design and information, hardware or software  is provided on an "as-is" basis without warranty of any kind and any express or implied warranties, including, but not limited to, the implied warranties of merchantability and fitness for a particular purpose are disclaimed. In no event shall wnpd (or KeaDrone)be liable for any direct, indirect, incidental, special, exemplary, or consequential damages (including, but not limited to, procurement of substitute goods or services; loss of use, data, or profits; or business interruption) however caused and on any theory of liability, whether in contract, strict liability, or tort (including negligence or otherwise) arising in any way out of the use of this firmware, hardware, software or information, even if wnpd (or KeaDrone) has been advised by user of the possibility of such potential loss or damage. The user agrees to hold wnpd (or KeaDrone) harmless from and against any and all claims, losses, liabilities and expenses.
- File:

### Library data of the parts
D1 = PMEG4030ER: Voltage: 40V; Current: 3A; LatestRevision Note: Initial Release; Part Number: PMEG4030ER; Type: Schottky; Package: SOD123W; Component Type: Standard; LatestRevision Date: 29-9-2010 9:43:01; Author: Willem Pietersz; ROHS: Y; Supplier 2: Farnell; Supplier Part Number 2: 1829202; ComponentLink2Description: Datasheet; ComponentLink2URL: http://www.nxp.com/documents/data_sheet/PMEG4030ER.pdf
F1 = 2920L185: Fuse; Manufacturer 1: Littlefuse; Voltage: 30V; Published: 8-Jun-2000; LatestRevisionDate: 17-Jul-2002; LatestRevisionNote: Re-released for DXP Platform.; PackageReference: PIN-W2/E2.8; Publisher: Altium Limited; Part Number: 2920L185; Current: 1.5A; Manufacturer 1 Part No: 2920L185; Supplier 2: Farnell; Supplier Part Number 2: 1822228; ComponentLink1Description: Datasheet; ComponentLink1URL: http://www.farnell.com/datasheets/578244.pdf
P5 = TB2: Con1x2; Part Number: TB2; Current: 10; Voltage: 300; Pitch: 3,5; LatestRevision Note: Initial Release; Type: Terminal Block; Number Of Pins: 2; Component Type: Standard; LatestRevision Date: 23-11-2010; Author: Willy Pietersz; Supplier 2: Farnell

## Sheet Zigbee interface.SchDoc: Xbee with dedicated PSU
size A4; Organization: Altium Limited; Address1: 3 Minna Close; Address2: Belrose; Address3: NSW 2085; Address4: Australia
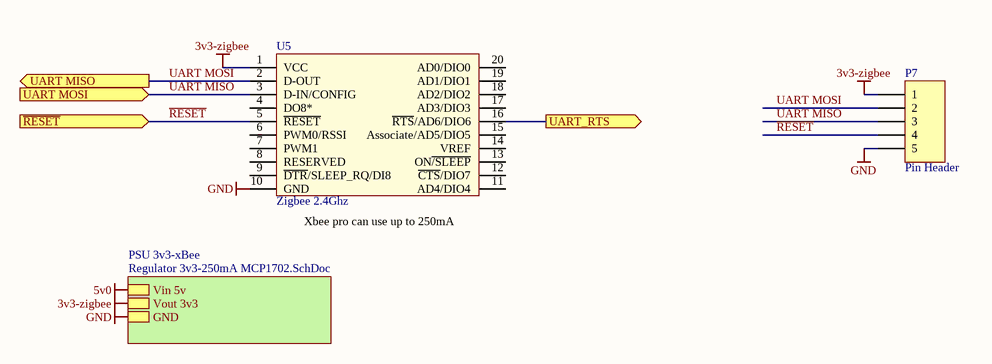
[diagram p9: Zigbee interface.SchDoc]

### Parts
P7  Pin Header  [PH1x5_2.54]
U5  Zigbee 2.4Ghz  [Zigbee_maxstream]

### Sub-sheets
PSU 3v3-xBee = Regulator 3v3-250mA MCP1702.SchDoc: Vin 5v, Vout 3v3, GND

### Ports
UART MISO (out), UART MOSI (in), UART_RTS (out), ~{RESET} (in)

### Nets
3v3-zigbee: P7.1 U5.1(VCC) ; sheet PSU 3v3-xBee/Vout 3v3
GND: P7.5 U5.10(GND) ; sheet PSU 3v3-xBee/GND
~{RESET}: P7.4 U5.5(~{RESET}) ; port ~{RESET}
UART MISO: P7.3 U5.3(D-IN/CONFIG) ; port UART MOSI
UART MOSI: P7.2 U5.2(D-OUT) ; port UART MISO
NetU5_16: U5.16(~{RTS}/AD6/DIO6) ; port UART_RTS

Not connected (* = marked no-connect by the designer): U5 4(DO8*) 6(PWM0/RSSI) 7(PWM1) 8(RESERVED) 9(~{DTR}/SLEEP_RQ/DI8) 11(AD4/DIO4) 12(~{CTS}/DIO7) 13(ON~{/SLEEP}) 14(VREF) 15(Associate/AD5/DIO5) 17(AD3/DIO3) 18(AD2/DIO2) 19(AD1/DIO1) 20(AD0/DIO0)

### Notes on the sheet
- (near U5) Xbee pro can use up to 250mA
- Disclaimer
  Any design and information, hardware or software  is provided on an "as-is" basis without warranty of any kind and any express or implied warranties, including, but not limited to, the implied warranties of merchantability and fitness for a particular purpose are disclaimed. In no event shall wnpd (or KeaDrone)be liable for any direct, indirect, incidental, special, exemplary, or consequential damages (including, but not limited to, procurement of substitute goods or services; loss of use, data, or profits; or business interruption) however caused and on any theory of liability, whether in contract, strict liability, or tort (including negligence or otherwise) arising in any way out of the use of this firmware, hardware, software or information, even if wnpd (or KeaDrone) has been advised by user of the possibility of such potential loss or damage. The user agrees to hold wnpd (or KeaDrone) harmless from and against any and all claims, losses, liabilities and expenses.
- Title
- Size:
- Date:
- A4
- Name:
- Time:
- Ing. W. Pietersz
- Revision:
- Sheet
- of
- WillyPietersz@gmail.com
- Contact:
- -
- www.wnpd.nl
- File:

### Library data of the parts
P7 = PH1x5: as P2 on sheet GYRO 3-AXIS - ITG-3200; Type: Pin Header; Number Of Pins: 5; Component Type: Standard; LatestRevision Date: 23-11-2010; Author: Willy Pietersz; Supplier 2: Farnell
U5 = Zigbee-WRL-08690: Wireless, zigbee module from Maxstream;; Part Number: Zigbee-WRL-08690; Component Type: Wireless, Zigbee; ComponentLink1Description: Datasheet; ComponentLink1URL: http://www.sparkfun.com/datasheets/Wireless/Zigbee/XBee-Datasheet.pdf

## Sheet ServoConnector.SchDoc: Servo connector in/out
size A4; Organization: Altium Limited; Address1: 3 Minna Close; Address2: Belrose; Address3: NSW 2085; Address4: Australia
Used 6 times, as channels U_Subsheets combined/ServoConnector1, U_Subsheets combined/ServoConnector2, U_Subsheets combined/ServoConnector3, U_Subsheets combined/ServoConnector4, U_Subsheets combined/ServoConnector5, U_Subsheets combined/ServoConnector6. Parts and nets are listed once, with the designators drawn on the sheet.
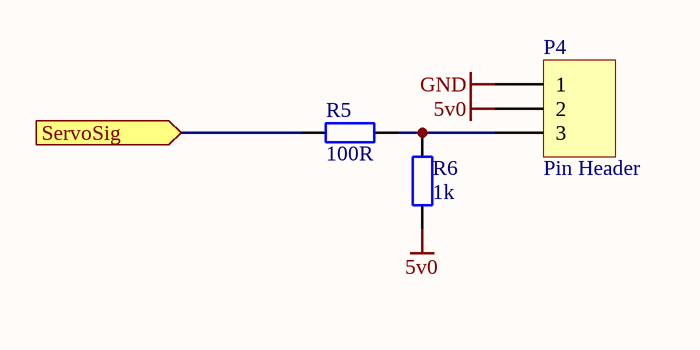
[diagram p10: ServoConnector.SchDoc]

### Parts
P4  Pin Header  [PH1x3_2.54]
R5  value 100R  [R0805]  (hidden comment: RESISTOR)
R6  value 1k  [R0805]  (hidden comment: RESISTOR)

### Ports
ServoSig (in)

### Nets
5v0: P4.2 R6.2
GND: P4.1
ServoSig: R5.2 ; port ServoSig
NetP4_3: P4.3 R5.1 R6.1

### Channels
U_Subsheets combined/ServoConnector1: designators end in A; ports ServoSig=ServoSig1
U_Subsheets combined/ServoConnector2: designators end in B; ports ServoSig=ServoSig2
U_Subsheets combined/ServoConnector3: designators end in C; ports ServoSig=ServoSig3
U_Subsheets combined/ServoConnector4: designators end in D; ports ServoSig=ServoSig4
U_Subsheets combined/ServoConnector5: designators end in E; ports ServoSig=ServoSig5
U_Subsheets combined/ServoConnector6: designators end in F; ports ServoSig=ServoSig6

### Notes on the sheet
- Disclaimer
  Any design and information, hardware or software  is provided on an "as-is" basis without warranty of any kind and any express or implied warranties, including, but not limited to, the implied warranties of merchantability and fitness for a particular purpose are disclaimed. In no event shall wnpd (or KeaDrone)be liable for any direct, indirect, incidental, special, exemplary, or consequential damages (including, but not limited to, procurement of substitute goods or services; loss of use, data, or profits; or business interruption) however caused and on any theory of liability, whether in contract, strict liability, or tort (including negligence or otherwise) arising in any way out of the use of this firmware, hardware, software or information, even if wnpd (or KeaDrone) has been advised by user of the possibility of such potential loss or damage. The user agrees to hold wnpd (or KeaDrone) harmless from and against any and all claims, losses, liabilities and expenses.
- Title
- Size:
- Date:
- A4
- Name:
- Time:
- Ing. W. Pietersz
- Revision:
- Sheet
- of
- WillyPietersz@gmail.com
- Contact:
- -
- www.wnpd.nl
- File:

### Library data of the parts
P4 = PH1x3: as P9 on sheet Temperature sensor - TC1046VNBTR; Type: Pin Header; Number Of Pins: 3; Component Type: Standard; LatestRevision Date: 23-11-2010; Author: Willy Pietersz; Supplier 2: Farnell
R5 = 100R: Manufacturer 1: Panasonic; Manufacturer 1 Part No: ERJT06J101V; Power: 0.25W; Tolerance: 0.05; LatestRevision Note: Initial Release; Published: 8-Jun-2000; LatestRevisionDate: 17-Jul-2002; LatestRevisionNote: Re-released for DXP Platform.; PackageReference: AXIAL-0.4; Publisher: Altium Limited; Part Number: 100R; Type: Film; Package: 0805; Component Type: Standard; LatestRevision Date: 30-7-2010; Author: Willy Pietersz; ROHS: Y; Supplier 2: Farnell; Supplier Part Number 2: 1618240; ComponentLink1Description: Manufacturer; ComponentLink2Description: Datasheet
R6 = 1K: Manufacturer 1: Panasonic; Manufacturer 1 Part No: ERJT06J102V; Power: 0.25W; Tolerance: 0.05; LatestRevision Note: Initial Release; Published: 8-Jun-2000; LatestRevisionDate: 17-Jul-2002; LatestRevisionNote: Re-released for DXP Platform.; PackageReference: AXIAL-0.4; Publisher: Altium Limited; Part Number: 1K; Type: Film; Package: 0805; Component Type: Standard; LatestRevision Date: 30-7-2010; Author: Willy Pietersz; ROHS: Y; Supplier 1: Farnell; Supplier Part Number 1: 1618241; ComponentLink1Description: Manufacturer; ComponentLink2Description: Datasheet

## Sheet LV-MaxSonar Connector.SchDoc
size A4; Organization: Altium Limited; Address1: 3 Minna Close; Address2: Belrose; Address3: NSW 2085; Address4: Australia
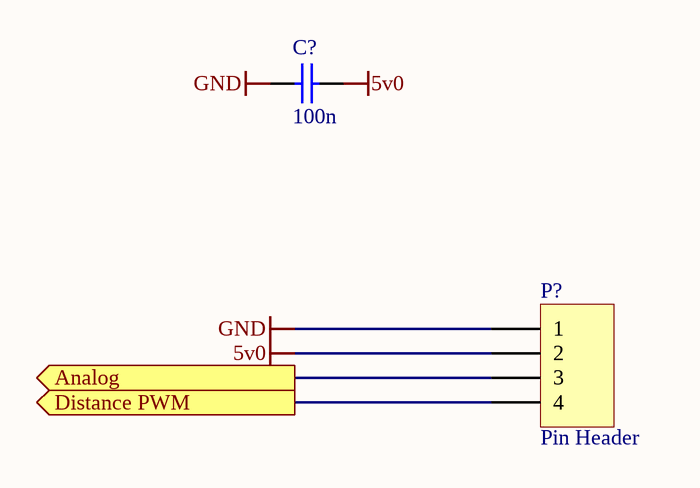
[diagram p11: LV-MaxSonar Connector.SchDoc]

### Parts
(Parts that share a designator on the sheet are numbered #1, #2 ... from top to bottom, then left to right.)
C?#11  100n  [C0805]
P?#5  Pin Header  [PH1x4_2.54]

### Ports
Analog (out), Distance PWM (out)

### Nets
5v0: C?#11.2 P?#5.2
GND: C?#11.1 P?#5.1
NetP?#5_3: P?#5.3 ; port Analog
NetP?#5_4: P?#5.4 ; port Distance PWM

### Notes on the sheet
- Title
- Size:
- Date:
- A4
- Name:
- Time:
- Ing. W. Pietersz
- Revision:
- Sheet
- of
- WillyPietersz@gmail.com
- Contact:
- -
- www.wnpd.nl
- Disclaimer
  Any design and information, hardware or software  is provided on an "as-is" basis without warranty of any kind and any express or implied warranties, including, but not limited to, the implied warranties of merchantability and fitness for a particular purpose are disclaimed. In no event shall wnpd (or KeaDrone)be liable for any direct, indirect, incidental, special, exemplary, or consequential damages (including, but not limited to, procurement of substitute goods or services; loss of use, data, or profits; or business interruption) however caused and on any theory of liability, whether in contract, strict liability, or tort (including negligence or otherwise) arising in any way out of the use of this firmware, hardware, software or information, even if wnpd (or KeaDrone) has been advised by user of the possibility of such potential loss or damage. The user agrees to hold wnpd (or KeaDrone) harmless from and against any and all claims, losses, liabilities and expenses.
- File:

### Library data of the parts
C?#11 = 100n: as C5 on sheet GYRO 3-AXIS - ITG-3200; Part Number: 100n; Value: 100n; Package: 0805; Component Type: Standard; LatestRevision Date: 31-7-2010; Author: Willy Pietersz; Supplier 2: Farnell; Supplier Part Number 2: 1759266; ComponentLink1Description: Manufacturer; ComponentLink2Description: Datasheet
P?#5 = PH1x4: Con1x4; Part Number: PH1x4; Pitch: 2.54; LatestRevision Note: Initial Release; Type: Pin Header; Number Of Pins: 4; Component Type: Standard; LatestRevision Date: 23-11-2010; Author: Willy Pietersz; Supplier 2: Farnell

## Sheet Battery Voltage 12v Max.SchDoc: Battery voltage monitor, 12v Max.
size A4; Organization: Altium Limited; Address1: 3 Minna Close; Address2: Belrose; Address3: NSW 2085; Address4: Australia
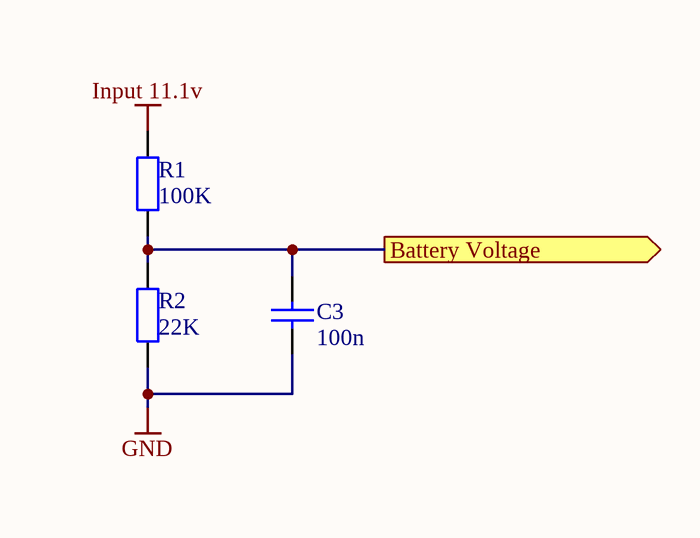
[diagram p12: Battery Voltage 12v Max.SchDoc]

### Parts
C3  100n  [C0805]
R1  value 100K  [R0805]  (hidden comment: RESISTOR)
R2  value 22K  [R0805]  (hidden comment: RESISTOR)

### Ports
Battery Voltage (out)

### Nets
GND: C3.1 R2.2
Input 11.1v: R1.1
Battery Voltage: C3.2 R1.2 R2.1 ; port Battery Voltage

### Notes on the sheet
- Disclaimer
  Any design and information, hardware or software  is provided on an "as-is" basis without warranty of any kind and any express or implied warranties, including, but not limited to, the implied warranties of merchantability and fitness for a particular purpose are disclaimed. In no event shall wnpd (or KeaDrone)be liable for any direct, indirect, incidental, special, exemplary, or consequential damages (including, but not limited to, procurement of substitute goods or services; loss of use, data, or profits; or business interruption) however caused and on any theory of liability, whether in contract, strict liability, or tort (including negligence or otherwise) arising in any way out of the use of this firmware, hardware, software or information, even if wnpd (or KeaDrone) has been advised by user of the possibility of such potential loss or damage. The user agrees to hold wnpd (or KeaDrone) harmless from and against any and all claims, losses, liabilities and expenses.
- Title
- Size:
- Date:
- A4
- Name:
- Time:
- Ing. W. Pietersz
- Revision:
- Sheet
- of
- WillyPietersz@gmail.com
- Contact:
- -
- www.wnpd.nl
- File:

### Library data of the parts
C3 = 100n: as C5 on sheet GYRO 3-AXIS - ITG-3200; Part Number: 100n; Value: 100n; Package: 0805; Component Type: Standard; LatestRevision Date: 31-7-2010; Author: Willy Pietersz; Supplier 2: Farnell; Supplier Part Number 2: 1759266; ComponentLink1Description: Manufacturer; ComponentLink2Description: Datasheet
R1 = 100K: Manufacturer 1: Panasonic; Manufacturer 1 Part No: ERJT06J104V; Power: 0.25W; Tolerance: 0.05; LatestRevision Note: Initial Release; Published: 8-Jun-2000; LatestRevisionDate: 17-Jul-2002; LatestRevisionNote: Re-released for DXP Platform.; PackageReference: AXIAL-0.4; Publisher: Altium Limited; Part Number: 100K; Type: Film; Package: 0805; Component Type: Standard; LatestRevision Date: 30-7-2010; Author: Willy Pietersz; ROHS: Y; Supplier 2: Farnell; Supplier Part Number 2: 1618243; ComponentLink1Description: Manufacturer; ComponentLink2Description: Datasheet
R2 = 22K: Manufacturer 1: Panasonic; Power: 0.25W; Tolerance: 0.05; LatestRevision Note: Initial Release; Published: 8-Jun-2000; LatestRevisionDate: 17-Jul-2002; LatestRevisionNote: Re-released for DXP Platform.; PackageReference: AXIAL-0.4; Publisher: Altium Limited; Part Number: 22K; Type: Film; Package: 0805; Component Type: Standard; LatestRevision Date: 30-7-2010; Author: Willy Pietersz; ROHS: Y; Supplier 2: Farnell; ComponentLink1Description: Manufacturer; ComponentLink2Description: Datasheet